# EAGLE schematic measure (EAGLE 6.2)
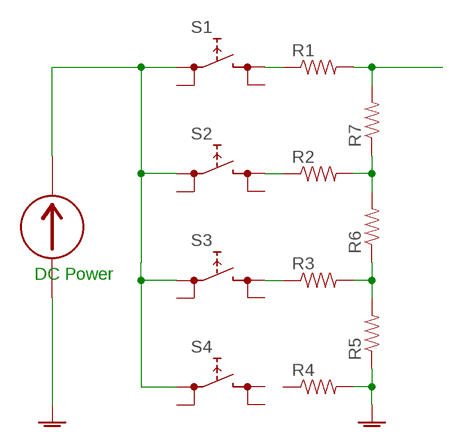
[diagram p0: schematic, sheet 1]

## Parts
DC_POEWR  DCPOWER  [PS12]
R1  RESISTORPTH-1/4W  [AXIAL-0.4]
R2  RESISTORPTH-1/4W  [AXIAL-0.4]
R3  RESISTORPTH-1/4W  [AXIAL-0.4]
R4  RESISTORPTH-1/4W  [AXIAL-0.4]
R5  RESISTORPTH-1/4W  [AXIAL-0.4]
R6  RESISTORPTH-1/4W  [AXIAL-0.4]
R7  RESISTORPTH-1/4W  [AXIAL-0.4]
S1  REKN  [REKN]
S2  REKN  [REKN]
S3  REKN  [REKN]
S4  REKN  [REKN]

## Nets
AGND: DC_POEWR.P$1(VGND) R4.P$2 R5.P$1
N$1: DC_POEWR.P$2(VOUT) S1.0A S2.0A S3.0A S4.0A
N$2: R1.P$1 S1.1A
N$3: R2.P$1 S2.1A
N$4: R3.P$1 S3.1A
N$5: R1.P$2 R7.P$2
N$6: R2.P$2 R6.P$2 R7.P$1
N$7: R3.P$2 R5.P$2 R6.P$1
Unconnected: R4.P$1 S1.0B S1.1B S2.0B S2.1B S3.0B S3.1B S4.0B S4.1A S4.1B

## Notes on the sheet
- DC Power

## Library data of the parts
DC_POEWR = My Library:DCPOWER
R1-R7 = My Library:RESISTOR: Resistor Basic schematic elements and footprints for 0603, 1206, and PTH resistors.
S1-S4 = switch:REKN: PUSH SWITCH ITT-Cannon-Cannon